# Altium schematic sheet Schematic.SchDoc
size 594 x 420 mm; SheetNumber: 1; SheetTotal: 2
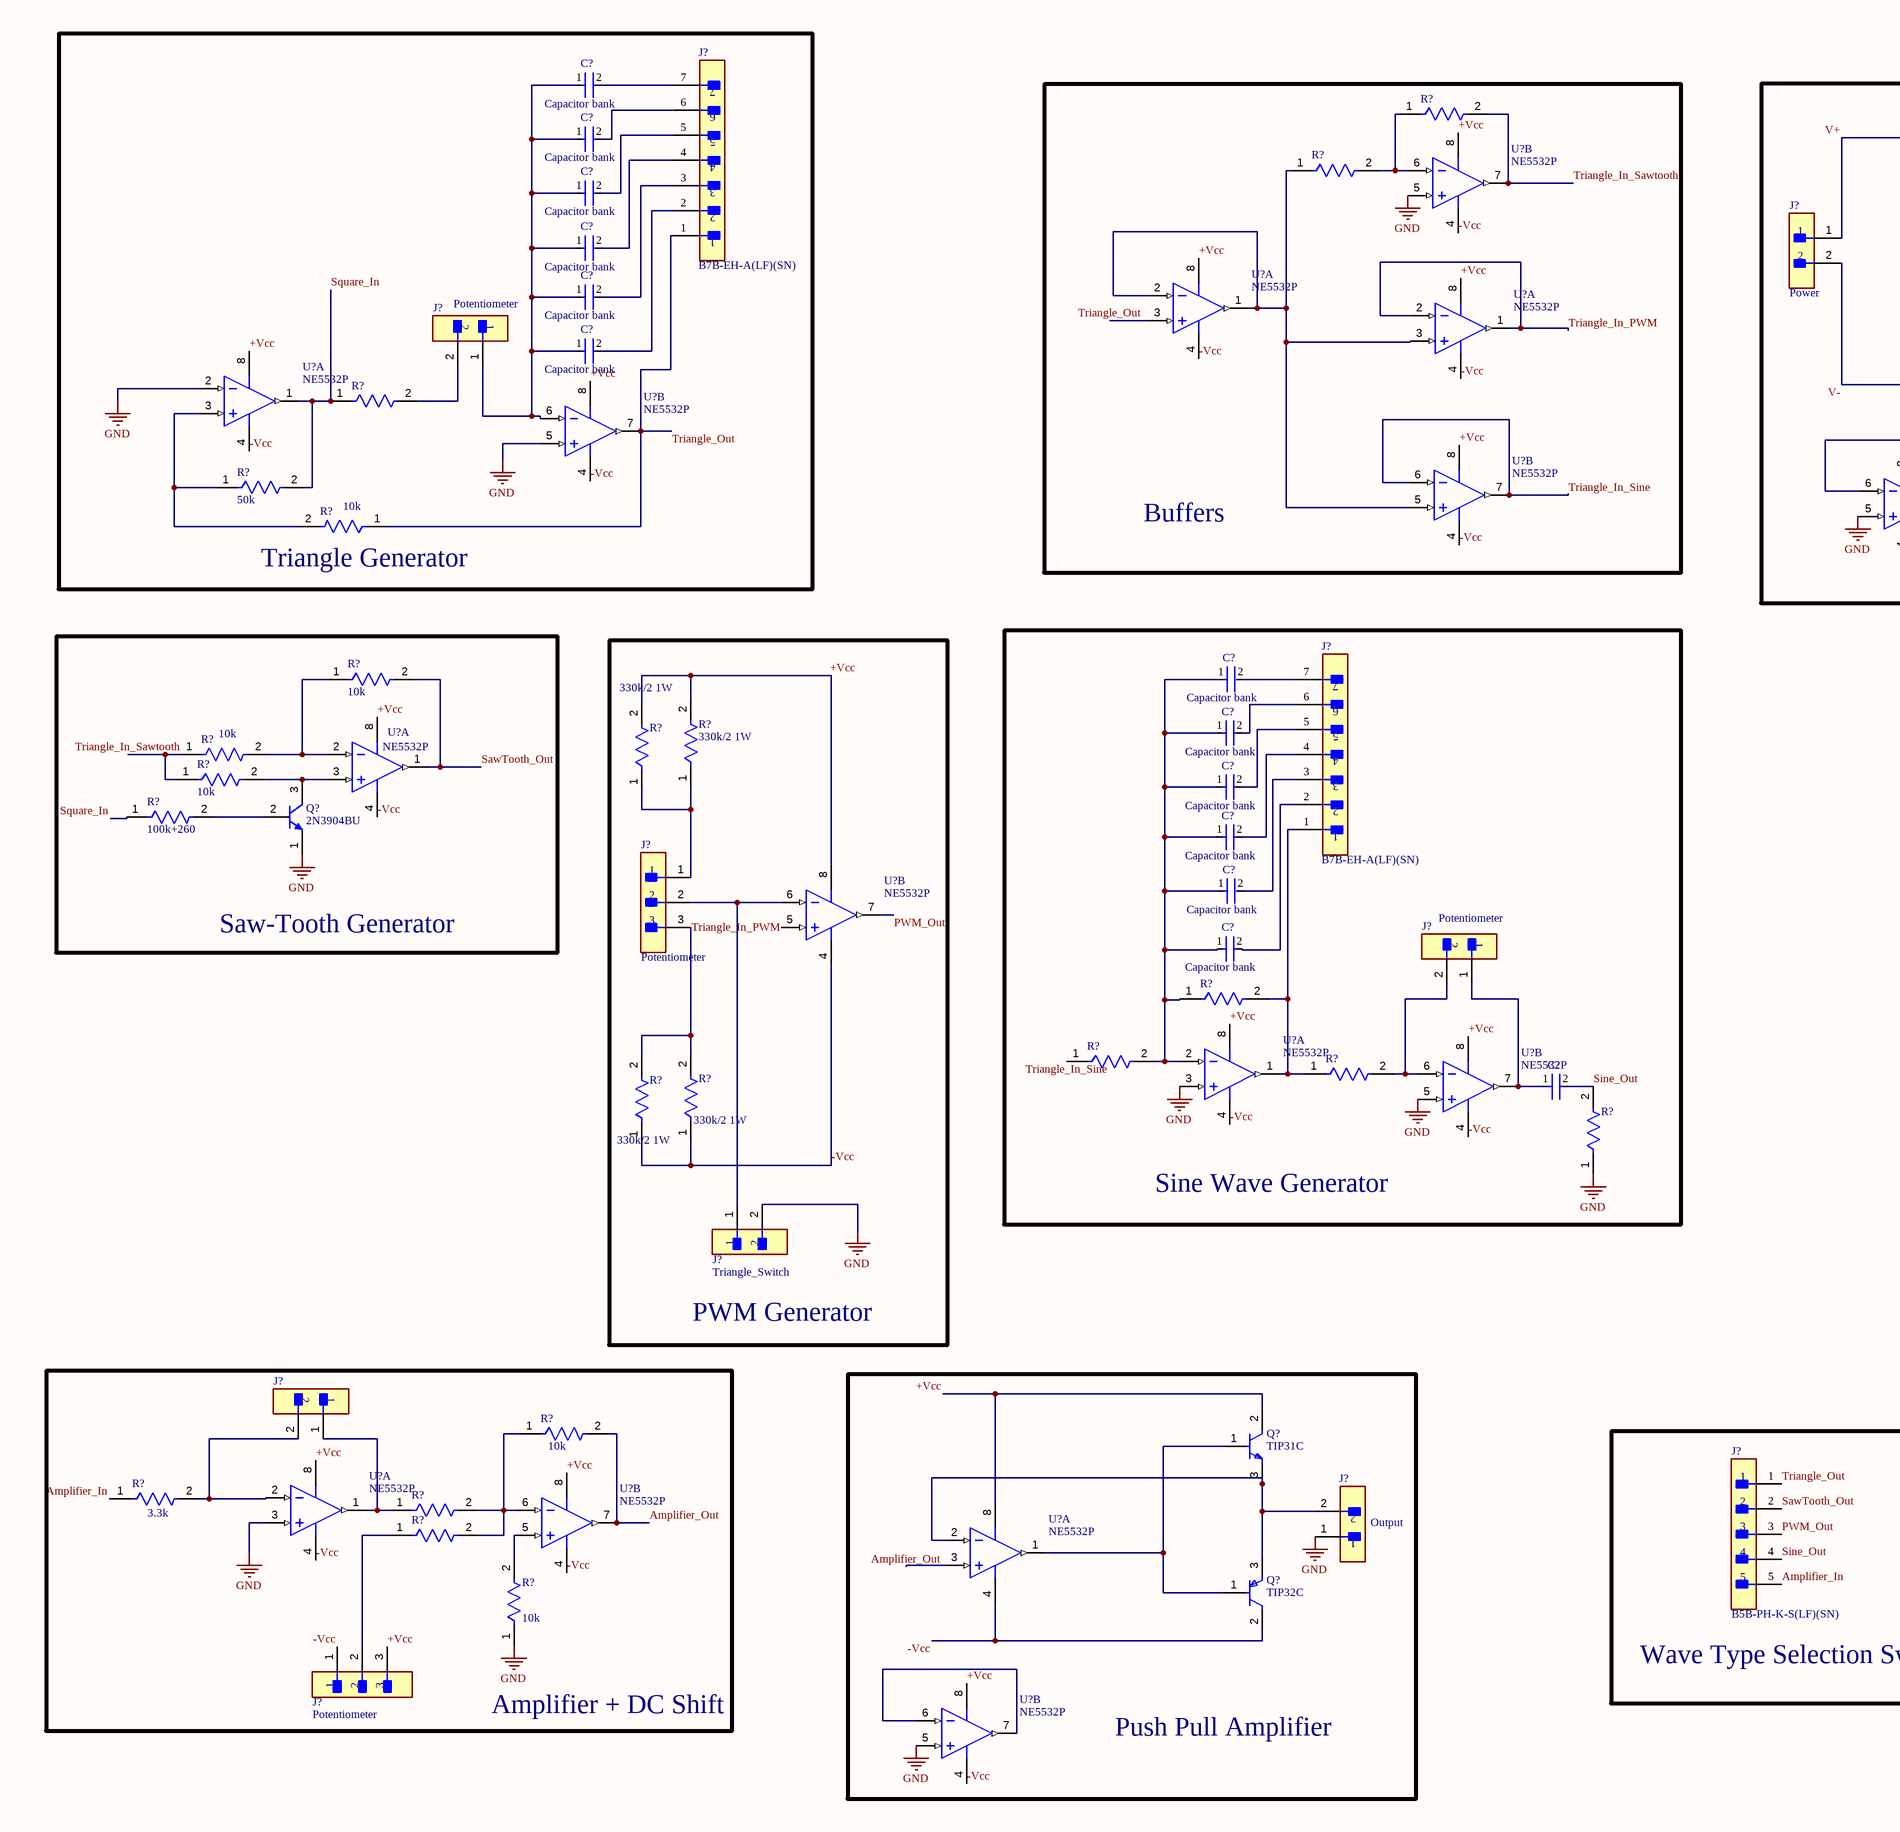
[diagram p0: Schematic.SchDoc, left]
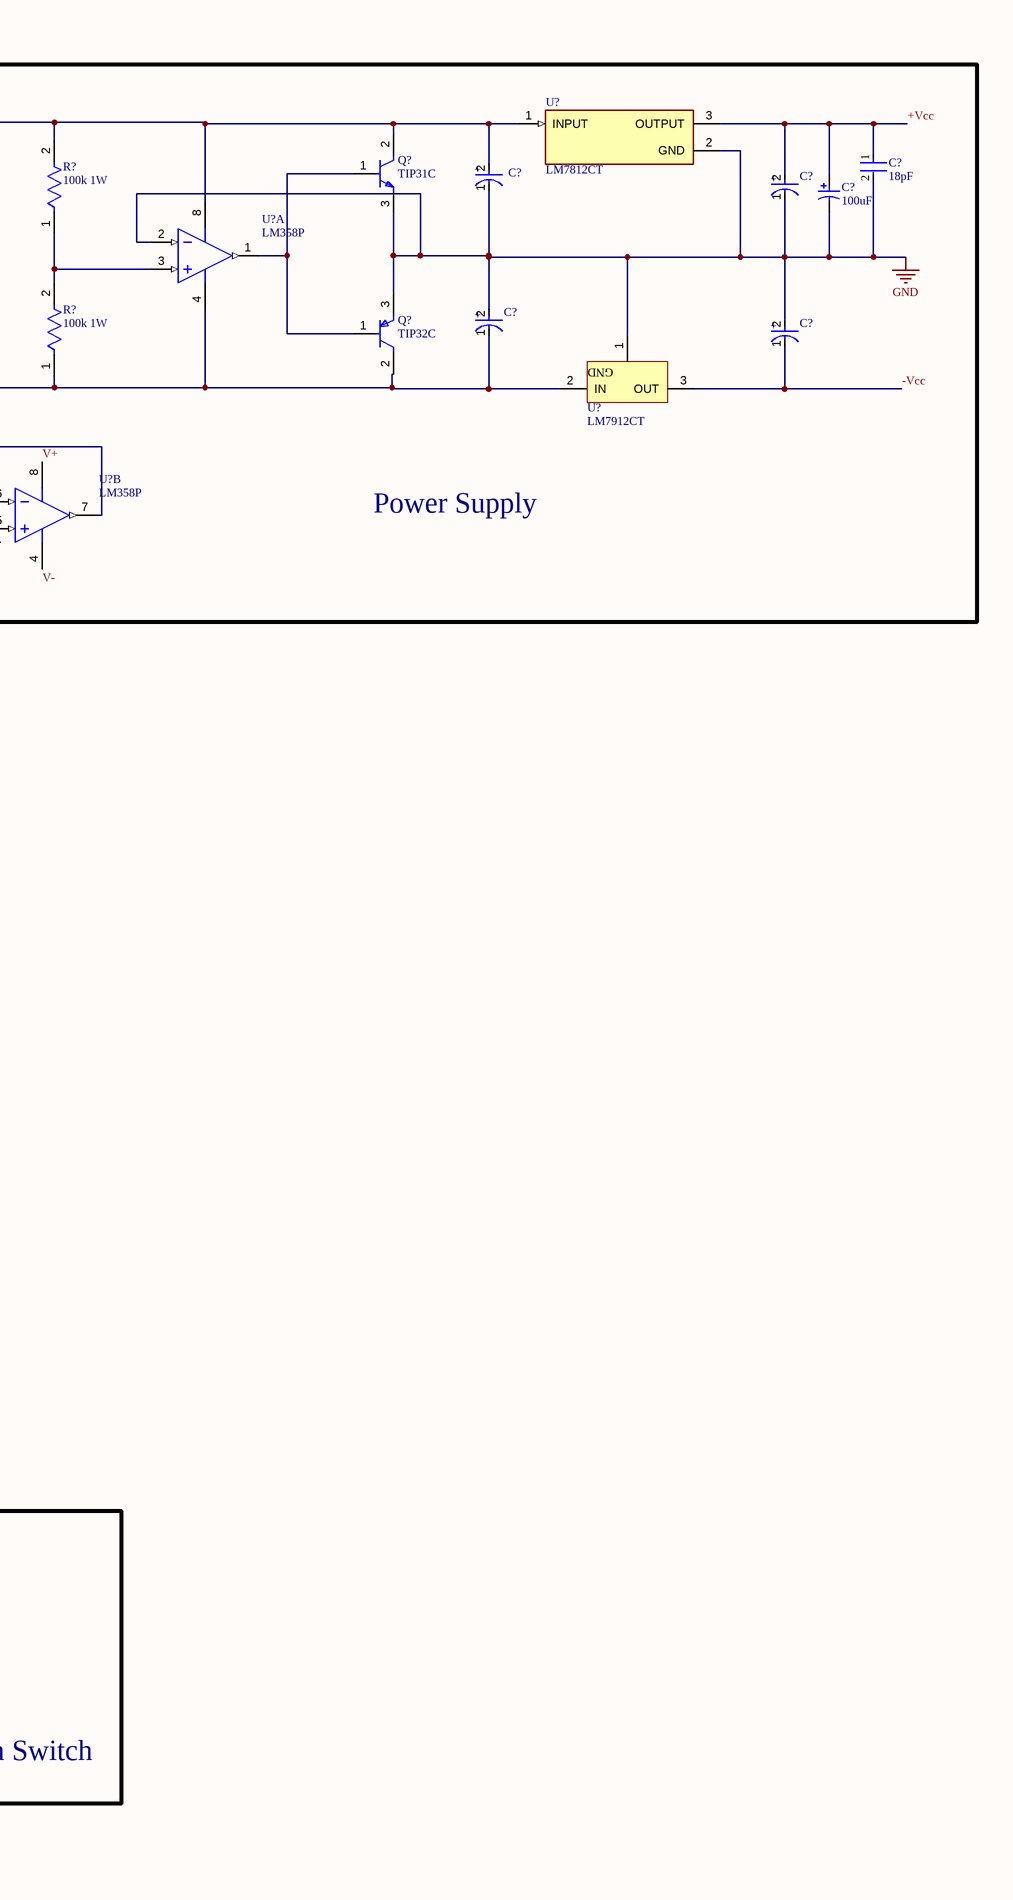
[diagram p1: Schematic.SchDoc, right]

## Parts
(Parts that share a designator on the sheet are numbered #1, #2 ... from top to bottom, then left to right.)
C?#1  Capacitor bank  [FP-F471K33Y5RP6UK5R-MFG]
C?#2  Capacitor bank  [FP-F471K33Y5RP6UK5R-MFG]
C?#3  18pF  [FP-F471K33Y5RP6UK5R-MFG]
C?#4  EEUFC1H4R7B  [FP-RAD-TH-D_5_0_5-L_11_1-MFG]  (value not drawn)
C?#5  EEUFC1H4R7B  [FP-RAD-TH-D_5_0_5-L_11_1-MFG]  (value not drawn)
C?#6  100uF  [CAPPR65-350-1150X800X1250]
C?#7  Capacitor bank  [FP-F471K33Y5RP6UK5R-MFG]
C?#8  Capacitor bank  [FP-F471K33Y5RP6UK5R-MFG]
C?#9  Capacitor bank  [FP-F471K33Y5RP6UK5R-MFG]
C?#10  EEUFC1H4R7B  [FP-RAD-TH-D_5_0_5-L_11_1-MFG]  (value not drawn)
C?#11  EEUFC1H4R7B  [FP-RAD-TH-D_5_0_5-L_11_1-MFG]  (value not drawn)
C?#12  Capacitor bank  [FP-F471K33Y5RP6UK5R-MFG]
C?#13  Capacitor bank  [FP-F471K33Y5RP6UK5R-MFG]
C?#14  Capacitor bank  [FP-F471K33Y5RP6UK5R-MFG]
C?#15  Capacitor bank  [FP-F471K33Y5RP6UK5R-MFG]
C?#16  Capacitor bank  [FP-F471K33Y5RP6UK5R-MFG]
C?#17  Capacitor bank  [FP-F471K33Y5RP6UK5R-MFG]
C?#18  Capacitor bank  [FP-F471K33Y5RP6UK5R-MFG]
C?#19  (no value)  [FP-F471K33Y5RP6UK5R-MFG]
J?#1  B7B-EH-A(LF)(SN)  [FP-B7B-EH-A_LF_SN-MFG]
J?#2  Power  [FP-B2B-XH-A_LF_SN-MFG]
J?#3  Potentiometer  [FP-B2B-XH-A_LF_SN-MFG]
J?#4  B7B-EH-A(LF)(SN)  [FP-B7B-EH-A_LF_SN-MFG]
J?#5  Potentiometer  [FP-440054-3-MFG]
J?#6  Potentiometer  [FP-B2B-XH-A_LF_SN-MFG]
J?#7  Triangle_Switch  [FP-B2B-XH-A_LF_SN-MFG]
J?#8  (no value)  [FP-B2B-XH-A_LF_SN-MFG]
J?#9  B5B-PH-K-S(LF)(SN)  [FP-B5B-PH-K-S_LF_SN-MFG]
J?#10  Output  [FP-B2B-XH-A_LF_SN-MFG]
J?#11  Potentiometer  [FP-440054-3-MFG]
Q?#1  TIP31C  [FP-TO-220-P0A0015988-MFG]
Q?#2  TIP32C  [FP-TO-220-P0A0015988-MFG]
Q?#3  2N3904BU  [FAIR-TO-92]
Q?#4  TIP31C  [FP-TO-220-P0A0015988-MFG]
Q?#5  TIP32C  [FP-TO-220-P0A0015988-MFG]
R?#1  (no value)  [FP-VR37-MFG]
R?#2  (no value)  [FP-VR37-MFG]
R?#3  100k 1W  [FP-RR01-MFG]
R?#4  100k 1W  [FP-RR01-MFG]
R?#5  (no value)  [FP-VR37-MFG]
R?#6  50k  [FP-VR37-MFG]
R?#7  10k  [FP-VR37-MFG]
R?#8  10k  [FP-VR37-MFG]
R?#9  10k  [FP-VR37-MFG]
R?#10  10k  [FP-VR37-MFG]
R?#11  330k/2 1W  [FP-RR01-MFG]
R?#12  330k/2 1W  [FP-RR01-MFG]
R?#13  100k+260  [FP-VR37-MFG]
R?#14  (no value)  [FP-VR37-MFG]
R?#15  (no value)  [FP-VR37-MFG]
R?#16  (no value)  [FP-VR37-MFG]
R?#17  330k/2 1W  [FP-RR01-MFG]
R?#18  330k/2 1W  [FP-RR01-MFG]
R?#19  (no value)  [FP-VR37-MFG]
R?#20  10k  [FP-VR37-MFG]
R?#21  3.3k  [FP-VR37-MFG]
R?#22  (no value)  [FP-VR37-MFG]
R?#23  (no value)  [FP-VR37-MFG]
R?#24  10k  [FP-VR37-MFG]
U?#1  LM7812CT  [FP-TO220B03-MFG]
U?#2  NE5532P  [P0008A]  (part B of 2)
U?#3  LM358P  [P0008A]  (part A of 2)
U?#4  NE5532P  [P0008A]  (part A of 2)
U?#5  NE5532P  [P0008A]  (part A of 2)
U?#6  NE5532P  [P0008A]  (part A of 2)
U?#7  LM7912CT  [NDE0003A]
U?#8  NE5532P  [P0008A]  (part B of 2)
U?#9  NE5532P  [P0008A]  (part B of 2)
U?#10  LM358P  [P0008A]  (part B of 2)
U?#11  NE5532P  [P0008A]  (part A of 2)
U?#12  NE5532P  [P0008A]  (part B of 2)
U?#13  NE5532P  [P0008A]  (part A of 2)
U?#14  NE5532P  [P0008A]  (part B of 2)
U?#15  NE5532P  [P0008A]  (part A of 2)
U?#16  NE5532P  [P0008A]  (part B of 2)
U?#17  NE5532P  [P0008A]  (part A of 2)
U?#18  NE5532P  [P0008A]  (part B of 2)

## Blocks framed on the sheet
Triangle Generator: C?#1 C?#2 C?#7-C?#9 C?#12 J?#1 J?#3 R?#5-R?#7 U?#6 U?#8
Buffers: R?#1 R?#2 U?#2 U?#4 U?#5 U?#9
Power Supply: C?#3-C?#6 C?#10 C?#11 J?#2 Q?#1 Q?#2 R?#3 R?#4 U?#1 U?#3 U?#7 U?#10
Saw-Tooth Generator: Q?#3 R?#8-R?#10 R?#13 U?#11
PWM Generator: J?#5 J?#7 R?#11 R?#12 R?#17 R?#18 U?#12
Sine Wave Generator: C?#13-C?#19 J?#4 J?#6 R?#14-R?#16 R?#19 U?#13 U?#14
Amplifier + DC Shift: J?#8 J?#11 R?#20-R?#24 U?#15 U?#16
Push Pull Amplifier: J?#10 Q?#4 Q?#5 U?#17 U?#18
Wave Type Selection Switch: J?#9

## Nets
GND: C?#3.2 C?#4.1(C) C?#5.1(C) C?#6.2 C?#10.2(A) C?#11.2(A) J?#7.2 J?#10.1 Q?#1.3(E) Q?#2.3(E) Q?#3.1(E) R?#19.1 R?#24.1 U?#1.2(GND) U?#2.5(IN2+) U?#3.2(1IN-) U?#6.2(IN1-) U?#7.1(GND) U?#8.5(IN2+) U?#10.5(2IN+) U?#13.3(IN1+) U?#14.5(IN2+) U?#15.3(IN1+) U?#18.5(IN2+)
+Vcc: C?#3.1 C?#5.2(A) C?#6.1 J?#11.3 Q?#4.2(C) R?#11.2 R?#12.2 U?#1.3(OUTPUT) U?#2.8(VCC+) U?#4.8(VCC+) U?#5.8(VCC+) U?#6.8(VCC+) U?#8.8(VCC+) U?#9.8(VCC+) U?#11.8(VCC+) U?#12.8(VCC+) U?#13.8(VCC+) U?#14.8(VCC+) U?#15.8(VCC+) U?#16.8(VCC+) U?#17.8(VCC+) U?#18.8(VCC+)
-Vcc: C?#11.1(C) J?#11.1 Q?#5.2(C) R?#17.1 R?#18.1 U?#2.4(VCC-) U?#4.4(VCC-) U?#5.4(VCC-) U?#6.4(VCC-) U?#7.3(OUT) U?#8.4(VCC-) U?#9.4(VCC-) U?#11.4(VCC-) U?#12.4(VCC-) U?#13.4(VCC-) U?#14.4(VCC-) U?#15.4(VCC-) U?#16.4(VCC-) U?#17.4(VCC-) U?#18.4(VCC-)
Amplifier_In: J?#9.5 R?#21.1
Amplifier_Out: R?#20.2 U?#16.7(OUT2) U?#17.3(IN1+)
PWM_Out: J?#9.3 U?#12.7(OUT2)
SawTooth_Out: J?#9.2 R?#8.2 U?#11.1(OUT1)
Sine_Out: C?#19.2 J?#9.4 R?#19.2
Square_In: R?#5.1 R?#6.2 R?#13.1 U?#6.1(OUT1)
Triangle_In_PWM: U?#5.1(OUT1) U?#5.2(IN1-) U?#12.5(IN2+)
Triangle_In_Sawtooth: R?#1.2 R?#9.1 R?#10.1 U?#2.7(OUT2)
Triangle_In_Sine: R?#15.1 U?#9.6(IN2-) U?#9.7(OUT2)
Triangle_Out: J?#1.1 J?#9.1 R?#7.1 U?#4.3(IN1+) U?#8.7(OUT2)
V+: C?#4.2(A) J?#2.1 Q?#1.2(C) R?#3.2 U?#1.1(INPUT) U?#3.8(VCC) U?#10.8(VCC)
V-: C?#10.1(C) J?#2.2 Q?#2.2(C) R?#4.1 U?#3.4(GND) U?#7.2(IN) U?#10.4(GND)
NetC?#1_1: C?#1.1 C?#2.1 C?#7.1 C?#8.1 C?#9.1 C?#12.1 J?#3.1 U?#8.6(IN2-)
NetC?#1_2: C?#1.2 J?#1.7
NetC?#2_2: C?#2.2 J?#1.6
NetC?#7_2: C?#7.2 J?#1.5
NetC?#8_2: C?#8.2 J?#1.4
NetC?#9_2: C?#9.2 J?#1.3
NetC?#12_2: C?#12.2 J?#1.2
NetC?#13_1: C?#13.1 C?#14.1 C?#15.1 C?#16.1 C?#17.1 C?#18.1 R?#14.1 R?#15.2 U?#13.2(IN1-)
NetC?#13_2: C?#13.2 J?#4.7
NetC?#14_2: C?#14.2 J?#4.6
NetC?#15_2: C?#15.2 J?#4.5
NetC?#16_2: C?#16.2 J?#4.4
NetC?#17_2: C?#17.2 J?#4.3
NetC?#18_2: C?#18.2 J?#4.2
NetC?#19_1: C?#19.1 J?#6.1 U?#14.7(OUT2)
NetJ?#3_2: J?#3.2 R?#5.2
NetJ?#4_1: J?#4.1 R?#14.2 R?#16.1 U?#13.1(OUT1)
NetJ?#5_1: J?#5.1 R?#11.1 R?#12.1
NetJ?#5_2: J?#5.2 J?#7.1 U?#12.6(IN2-)
NetJ?#5_3: J?#5.3 R?#17.2 R?#18.2
NetJ?#6_2: J?#6.2 R?#16.2 U?#14.6(IN2-)
NetJ?#8_1: J?#8.1 R?#22.1 U?#15.1(OUT1)
NetJ?#8_2: J?#8.2 R?#21.2 U?#15.2(IN1-)
NetJ?#10_2: J?#10.2 Q?#4.3(E) Q?#5.3(E) U?#17.2(IN1-)
NetJ?#11_2: J?#11.2 R?#23.1
NetQ?#1_1: Q?#1.1(B) Q?#2.1(B) U?#3.1(1OUT)
NetQ?#3_2: Q?#3.2(B) R?#13.2
NetQ?#3_3: Q?#3.3(C) R?#10.2 U?#11.3(IN1+)
NetQ?#4_1: Q?#4.1(B) Q?#5.1(B) U?#17.1(OUT1)
NetR?#1_1: R?#1.1 R?#2.2 U?#2.6(IN2-)
NetR?#2_1: R?#2.1 U?#4.1(OUT1) U?#4.2(IN1-) U?#5.3(IN1+) U?#9.5(IN2+)
NetR?#3_1: R?#3.1 R?#4.2 U?#3.3(1IN+)
NetR?#6_1: R?#6.1 R?#7.2 U?#6.3(IN1+)
NetR?#8_1: R?#8.1 R?#9.2 U?#11.2(IN1-)
NetR?#20_1: R?#20.1 R?#22.2 R?#23.2 U?#16.6(IN2-)
NetR?#24_2: R?#24.2 U?#16.5(IN2+)
NetU?#10_6: U?#10.6(2IN-) U?#10.7(2OUT)
NetU?#18_6: U?#18.6(IN2-) U?#18.7(OUT2)

## Notes on the sheet
- DWG NO:
- REV:
- THIS DOCUMENT AND THE DATA DISCLOSED HEREIN OR
- HEREWITH IS THE PROPERTY OF ALTIUM LIMITED AND MAY
- BE FREELY DISTRIBUTED IN WHOLE. NO RIGHTS ARE
- RESERVED OR EXPRESS OR IMPLIED WARANTEE GIVEN.
- REVISION
- DESCRIPTION
- DATE
- APPROVED
- ENG:
- APPROVALS
- PROJECT
- DSN:
- CHK:
- REFERENCE DOCUMENTS
- PROJECT REVISION:
- TITLE
- DOCUMENT REVISION:
- DESIGN ITEM:
- BOM:
- FAB DWG:
- PCB DWG:
- ASSY DWG:
- SCALE:
- A2
- SIZE
- CAGE CODE
- FILE NAME
- DWG NO.
- SHEET
- OF
- REV
- (in symbol CMP-05427-000609-1) +

## Library data of the parts
C?#1-C?#3 C?#7-C?#9 C?#12-C?#19 = CMP-02417-000080-1: CAP CER 470PF 2KV Y5R RADIAL; Tolerance: 10%; Dielectric Material: Ceramic; Insulation Resistance: 10GR; Lead/Base Style: Kinked; Lead Diameter: 0.8mm; Series: F; Depth: 5mm; Package Quantity: 1500; Resistor Type: Ceramic; Construction: RADIAL; Min Operating Temperature: -30°C; Mount: Through Hole; Radiation Hardening: No; Voltage: 2kV; Voltage Rating: 2kV; Max Operating Temperature: 125°C; Termination: Radial; RoHS Compliant: Yes; Lead Pitch: 5mm; Capacitance: 470pF; Packaging: Tape and Reel; Length: 8.5mm; Case/Package: Radial; Dielectric: Y5R
C?#4 C?#5 C?#10 C?#11 = CMP-05427-000609-1: Aluminum Electrolytic Capacitors (Radial Lead Type) AEC-Q200 Qualified 4.7uF ±20% 50V; Impedance: 1.3R; Life (Hours): 1000Hour; Polarity: Polar; Lead Diameter: 0.5mm; Ripple Current: 95mA; Ratings: AEC-Q200; Voltage Rating (DC): 50V; Voltage Rating: 50V; Lead Pitch: 5mm; Features: General Purpose; Height: 11mm; Radiation Hardening: No; Diameter: 5mm; Termination: Radial; Length: 11mm; Min Operating Temperature: -55°C; Height - Seated (Max): 0.472inch; Packaging: Tape and Reel; Max Operating Temperature: 105°C; ESR (Equivalent Series Resistance): 1.3R; RoHS Compliant: Yes; Package Quantity: 2000; Mount: Through Hole; Tolerance: 20%; Series: FC; Case/Package: Radial; Contact Plating: Tin
C?#6 = CMP-1665-00042-2: Aluminum Electrolytic Capacitor, 100 uF, +/- 20%, 50 V, -40 to 85 degC, 2-Pin THD, RoHS, Bulk; Manufacturer: Panasonic; Lead Diameter: 0.6mm; Dielectric Material: Aluminium; Voltage Rating (DC): 50V; Ripple Current (AC): 250mA; Polarity: Polar; Leakage Current: 3uA; Life (Hours): 2000Hour; Lead/Base Style: Straight; Dissipation Factor: 0.12%; Radiation Hardening: No; Height: 11.5mm; Package Quantity: 200; Package Reference: CAPPR65-350-1150X800X1250; Min Operating Temperature: -40degC; Mount: ThroughHole; Package Description: 2-Pin Radial Lead, Dia 8 mm, Height 12.5 mm; Case/Package: Radial; Diameter: 8mm; Voltage Rating: 50V; Length: 11.5mm; REACH SVHC: NoSVHC; Height - Seated (Max): 0.492inch; Datasheet URL: https://industrial.panasonic.com/cdbs/www-data/pdf/RDF0000/ABA0000C1218.pdf; RoHSCompliant: true; Ripple Current: 250mA; Lead Free: LeadFree; Voltage: 50V; Manufacturer URL: http://www.panasonic.com/; Number of Pins: 2; Datasheet Version: Rev. 05, 10/2016; Packaging: Bulk; Termination: Radial; Max Operating Temperature: 85degC; Tolerance: 20%; Capacitance: 100uF; Lead Pitch: 3.5mm
J?#1 J?#4 = CMP-17439-000532-1: CONN HEADER VERT 7POS 2.5MM; Number of Contacts: 7; Mated Stacking Heights: 8.1mm; Gender: Male; Current Rating: 3A; Voltage Rating: 250V; Termination: Solder; Contact Material: Brass; Connector Type: Header; Flammability Rating: UL94 V-0; Housing Material: Nylon; Series: EH; Fastening Type: Friction; Lead Free: Lead Free; Insulation Color: Natural; Contact Type: Male Pin; Number of Rows: 1; Packaging: Bulk; Color: Natural; Contact Finish - Mating: TIN; Orientation: Straight; Contact Shape: Square; Contact Plating: Tin; Insulation Material: Nylon; Housing Color: White; Mount: Through Hole; Contact Mating Length: 0.13inch; Pitch: 2.5mm; Number of Positions: 7
J?#2 J?#3 J?#6-J?#8 J?#10 = CMP-2000-05888-3: CONN HEADER VERT 2POS 2.5MM; Current Rating: 3A; Voltage Rating: 250V; Number of Contacts: 2; Contact Resistance: 20mR; Wire/Cable Gauge: 22AWG; Insulation Resistance: 1GR; Connector Type: Male Pin; Packaging: Bulk; Contact Material: Brass; Lead Free: Lead Free; Orientation: Straight; Contact Plating: Tin; Max Current Rating: 3A; Termination: Solder; Fastening Type: Detent; Depth: 5.75mm; Housing Material: Polyamide; REACH SVHC: No SVHC; Series: XH; Voltage Rating (AC): 250V; Number of Positions: 2; Color: Natural; Contact Type: Male Pin; Max Voltage Rating (DC): 250V; Pitch: 2.5mm; Lead Pitch: 2.5mm; Mount: Through Hole; Max Operating Temperature: 85°C; Length: 7.4mm; Max Voltage Rating (AC): 250V; Min Operating Temperature: -25°C; Number of Rows: 1; Housing Color: White
J?#5 J?#11 = CMP-03369-000008-1: CONN HEADER VERT 3POS 2MM; Manufacturer: TE Connectivity; Manufacturer Part Number: 440054-3; Voltage Rating: 250V; Number Of Contacts: 3; Conn Gender: Male; Conn Orientation: Vertical; Current Rating: 3A; Octopart: https://octopart.com/440054-3-te+connectivity-40394845; Device Class L3: unset; Device Class L1: Connectors; Number Of Rows: 1; Temperature: -25°C to +105°C; Temperature Range Low: -25°C; Automotive: No; Package: 0; ComponentLink2URL: https://www.te.com/usa-en/product-440054-3.datasheet.pdf; Device Class L2: Headers and Wire Housings; Temperature Range High: +105°C; Digikey Description: CONN HEADER VERT 3POS 2MM; Contact Material: Tin,Nickel; Footprint Url: https://www.te.com/commerce/DocumentDelivery/DDEController?Action=showdoc&DocId=Customer+Drawing%7F440054%7FF6%7Fpdf%7FEnglish%7FENG_CD_440054_F6.pdf%7F440054-3; RoHS: TRUE; ComponentLink2Description: Datasheet; Mouser Description: Headers & Wire Housings 3 POS HDR VERT 2.0mm; Lead Free: Yes; Category: Conn; Height: 6.35mm; Pitch: 2mm
J?#9 = CMP-2000-05908-2: CONN HEADER VERT 5POS 2MM; Voltage Rating (AC): 100V; Number of Positions: 5; Contact Resistance: 20mR; Insulation Resistance: 1MR; Current Rating: 2A; Gender: Male; Mated Stacking Heights: 8mm; Series: PH; Number of Poles: 5; Width: 4.5mm; Insulation Color: Natural; Fastening Type: Detent; Flammability Rating: UL94 V-0; Mount: Through Hole; Lead Free: Lead Free; Number of Rows: 1; REACH SVHC: No SVHC; Max Voltage Rating (AC): 100V; Contact Mating Length: 0.13inch; Contact Plating: Tin; Housing Material: Polyamide; Depth: 4.5mm; Contact Type: Male Pin; Voltage Rating: 100V; Color: Natural; Housing Color: White; Lead Pitch: 2mm; Number of Contacts: 5; Orientation: Straight; Packaging: Bulk; Contact Material: Brass; Pitch: 2mm; Insulation Material: Nylon; Connector Type: Header; Contact Finish - Mating: TIN; Termination: Solder; Number of Pins: 5; Length: 11.9mm; Contact Shape: Square; Max Current Rating: 2A; Working Voltage: 100V; Min Operating Temperature: -25°C; Max Operating Temperature: 85°C; Material: Polyamide; Height: 9.4mm
Q?#1 Q?#4 = CMP-12195-000001-1: TRANS NPN 100V 3A TO-220; Manufacturer: STMicroelectronics; Hfe Max: 50; Number Of Npn: 1; Max Junction Temp: +150°C; Standoff Height: 3.5mm; Emitter Base Voltage: 5V; Collector Emitter Saturation Voltage: 1.2V; Power Dissipation: 2W; Hfe Testvce: 4V; Hfe Min: 10; Device Class L2: Transistors; ComponentLink2URL: https://www.st.com/resource/en/datasheet/tip31c.pdf; Device Class L1: Discrete Semiconductors; Digikey Description: TRANS NPN 100V 3A TO-220; Max Collector Current: 3A; RoHS: TRUE; Height: 19.68mm; Mouser Description: Bipolar Transistors - BJT NPN Gen Pur Power; Number Of Elements: 1; Package: TO-220-P0A0015988; Temperature: to +150°C; Octopart: https://octopart.com/tip31c-stmicroelectronics-15555; Manufacturer Part Number: TIP31C; Category: Trans; Hfe Testic: 3A; Lead Free: Yes; Collector Base Voltage: 100V; Device Class L3: BJTs; Collector Emitter Voltage: 100V; Automotive: No; ComponentLink2Description: Datasheet; Temperature Range High: +150°C
Q?#2 Q?#5 = CMP-12195-000005-1: TRANS PNP 100V 3A TO-220; Manufacturer: STMicroelectronics; Standoff Height: 3.5mm; Number Of Pnp: 1; Max Collector Current: -3A; Emitter Base Voltage: -5V; Collector Emitter Voltage: -100V; Hfe Testvce: -4V; Hfe Max: 50; Collector Emitter Saturation Voltage: -1.2V; Power Dissipation: 2W; Max Junction Temp: +150°C; Hfe Min: 10; Device Class L3: BJTs; Mouser Description: Original ST Microelectronics Transistor, 100V, 3A, .22 Ohm, TO-220 Package; ComponentLink2Description: Datasheet; Device Class L1: Discrete Semiconductors; Automotive: No; Number Of Elements: 1; Category: Trans; Collector Base Voltage: -100V; Package: TO-220-P0A0015988; Height: 19.68mm; Lead Free: Yes; ComponentLink2URL: https://www.st.com/resource/en/datasheet/tip32c.pdf; Hfe Testic: -3A; RoHS: TRUE; Temperature Range High: +150°C; Temperature: to +150°C; Device Class L2: Transistors; Digikey Description: TRANS PNP 100V 3A TO-220; Octopart: https://octopart.com/tip32c-stmicroelectronics-353617; Manufacturer Part Number: TIP32C
Q?#3 = CMP-2000-04944-1: NPN General-Purpose Amplifier, 40 V VCEO, 0.2 A, -55 to 150 degC, 2-Pin TO-92, RoHS, Bulk; Manufacturer: FairchildSemiconductor; Maximum Collector Base Voltage: 60V; Minimum DC Current Gain: 40@0.1mA@1V; Maximum Collector Emitter Voltage: 40V; Maximum DC Collector Current: 0.2A; Rad Hard: No; Maximum Operating Frequency: 300(Min)MHz; Maximum Collector Emitter Saturation Voltage: 0.2@1mA@10mA; Maximum Power Dissipation: 625mW; Package Description: 3-Pin Transistor Outline Package, Body Dia 4.79 mm, Pitch 1.27 mm; Package Reference: TO-92; Pin Count: 3; Operating Temperature: -55to150degC; Category: GPBJT; Manufacturer URL: https://www.fairchildsemi.com/; Datasheet URL: https://datasheet.ciiva.com/4722/2n3904-82270-4722369.pdf; Package: 3TO-92; Packaging: Bulk; Type: NPN; Datasheet Version: Rev. 1.1.0, 10/2014; Mounting: ThroughHole
R?#1 R?#2 R?#5-R?#10 R?#13-R?#16 R?#19-R?#24 = CMP-02408-000054-1: RES 1.2M OHM 5% 1/2W AXIAL; Voltage Rating: 3.5kV; Power Rating: 500mW; Temperature Coefficient: 200ppm/°C; Resistance: 1.2MR; Diameter: 4mm; Max Operating Temperature: 155°C; Military Standard: Not; Reach SVHC Compliant: Yes; Min Operating Temperature: -55°C; Resistance Tolerance: 5%; Resistor Type: Metal Film; Tolerance: 5%; Mount: Through Hole; Construction: Cylindrical; Contact Plating: Tin; Length: 10mm; Termination: Axial; Voltage Rating (DC): 3.5kV; Packaging: Ammo Pack; Radiation Hardening: No; Case/Package: Conformal
R?#3 R?#4 R?#11 R?#12 R?#17 R?#18 = CMP-03212-000008-1: RES 100K OHM 5% 1W AXIAL; Number of Resistors: 1; Temperature Coefficient: 300ppm/°C; Voltage Rating: 350V; Resistance: 100kR; Package Quantity: 5000; Power Rating: 1W; Packaging: Ammo Pack; Min Operating Temperature: -55°C; Number of Terminations: 2; Resistor Type: Power resistor; Length: 6.8mm; ELV: Compliant; Mount: Axial; RoHS Compliant: Yes; Case/Package: Metal; Diameter: 2.6mm; Termination: Axial; Series: RR; Max Operating Temperature: 155°C; Tolerance: 5%
U?#1 = CMP-07128-000015-1: IC REG LINEAR 12V 1A TO220-3; Obsolete Part: true; Manufacturer: ON Semiconductor; Nominal Supply Current: 5.1mA; Output Type: Fixed; Dropout Voltage: 2V; Max Supply Voltage: 35V; Accuracy Percentage: 4%; Standoff Height: 2.7mm; Number Of Outputs: 1; Octopart: https://octopart.com/lm7812ct-on+semiconductor-14383031; Output Current: 1A; ComponentLink2Description: Datasheet; Device Class L1: Integrated Circuits (ICs); Device Class L2: Power Management ICs; Temperature Range Low: -40°C; Category: IC; Package: TO220B03; Device Class L3: Voltage Regulators - Linear; RoHS: TRUE; Digikey Description: IC REG LINEAR 12V 1A TO220-3; Ipc Land Pattern Name: TO-220; Output Voltage: 12V; Temperature: -40°C to +125°C; Automotive: No; Temperature Range High: +125°C; ComponentLink2URL: https://www.mouser.in/datasheet/2/308/LM7812-1125088.pdf; Manufacturer Part Number: LM7812CT; Height: 20.4mm; Lead Free: Yes
U?#2 U?#4-U?#6 U?#8 U?#9 U?#11-U?#18 = CMP-0017-00910-2: Dual Low-Noise High-Speed Audio Operational Amplifier, 10 to 30 V, 0 to 70 degC, 8-pin DIP (P8), Pb-Free (RoHS); Manufacturer: Texas Instruments; Iq per channel(Max)(mA): 4; Slew Rate(Typ)(V/us): 9; Vn at 1kHz(Typ)(nV/rtHz): 5; IIB(Max)(pA): 800000; Total Supply Voltage(Max)(+5V is 5, +/-5V is 10): 30; GBW(Typ)(MHz): 10; CMRR(Min)(dB): 70; Number of Channels: 2; Sub Family: General Purpose Amplifier, High Supply Voltage Amplifier (>=30V), Low Noise Amp (<=10nV/rtHz); ComponentLink2URL: http://www.ti.com/lit/ds/symlink/ne5532.pdf; PackageReference: P0008A; PackageDescription: 8-Pin Plastic In-Line, Body 9.59 x 6.35 mm, Pitch 2.54 mm; ComponentLink1Description: Manufacturer URL; Eco-Plan: Pb-Free (RoHS); Mounting Technology: Through Hole; Code_JEDEC: MS-001; PackageVersion: 4040082/E, 04/2010; DatasheetVersion: SLOS075I; ComponentLink3URL: http://www.ti.com/litv/pdf/mpdi001b; ComponentLink2Description: Datasheet; Vio (25C)(Max)(mV): 4; PartNumber: NE5532P; ComponentLink3Description: Package Specification; Total Supply Voltage(Min)(+5V is 5, +/-5V is 10): 10; ComponentLink1URL: http://www.ti.com/
U?#3 U?#10 = CMP-2000-06549-1: Dual Operational Amplifier, 3 to 32 V, 0 to 70 degC, 8-Pin PDIP (P), RoHS, Tape and Reel; Manufacturer: Technik Industrial; Datasheet Version: Rev. T, 04/2015; Datasheet URL: http://www.ti.com/lit/ds/symlink/lm358.pdf; Manufacturer URL: http://www.technik.com.hk/; Package Description: 8-Pin Double In-line Package, Body 9.59 x 6.35 mm, Pitch 2.54 mm; Mounting Technology: ThroughHole; Package URL: http://www.ti.com/lit/ml/mpdi001b/mpdi001b.pdf; Package Reference: P8
U?#7 = CMP-0062-02472-3: 3-Terminal Negative Regulator, 3-pin TO-220; Manufacturer: Texas Instruments; CompType: LDO IC; PowerWise: N; PackageTopMarking: NSUZXYTTE#*LM7912CT; PinCount: 3; RoHS: N; PackageDescription: TO-220, Molded, 3 Lead, Straight; ComponentLink1URL: http://www.ti.com/general/docs/lit/getliterature.tsp?genericPartNumber=LM7912&fileType=pdf; PackageReference: NDE0003A; ComponentLink1Description: Datasheet URL